# Altium schematic sheet 3V3-CAN-UNISOLATED.SchDoc
size A4; Organization: UNSW Solar Racing Team; Address3: UNSW; Address4: Sydney NSW 2052; Address2: Electrical Engineering; Address1: Rm 109
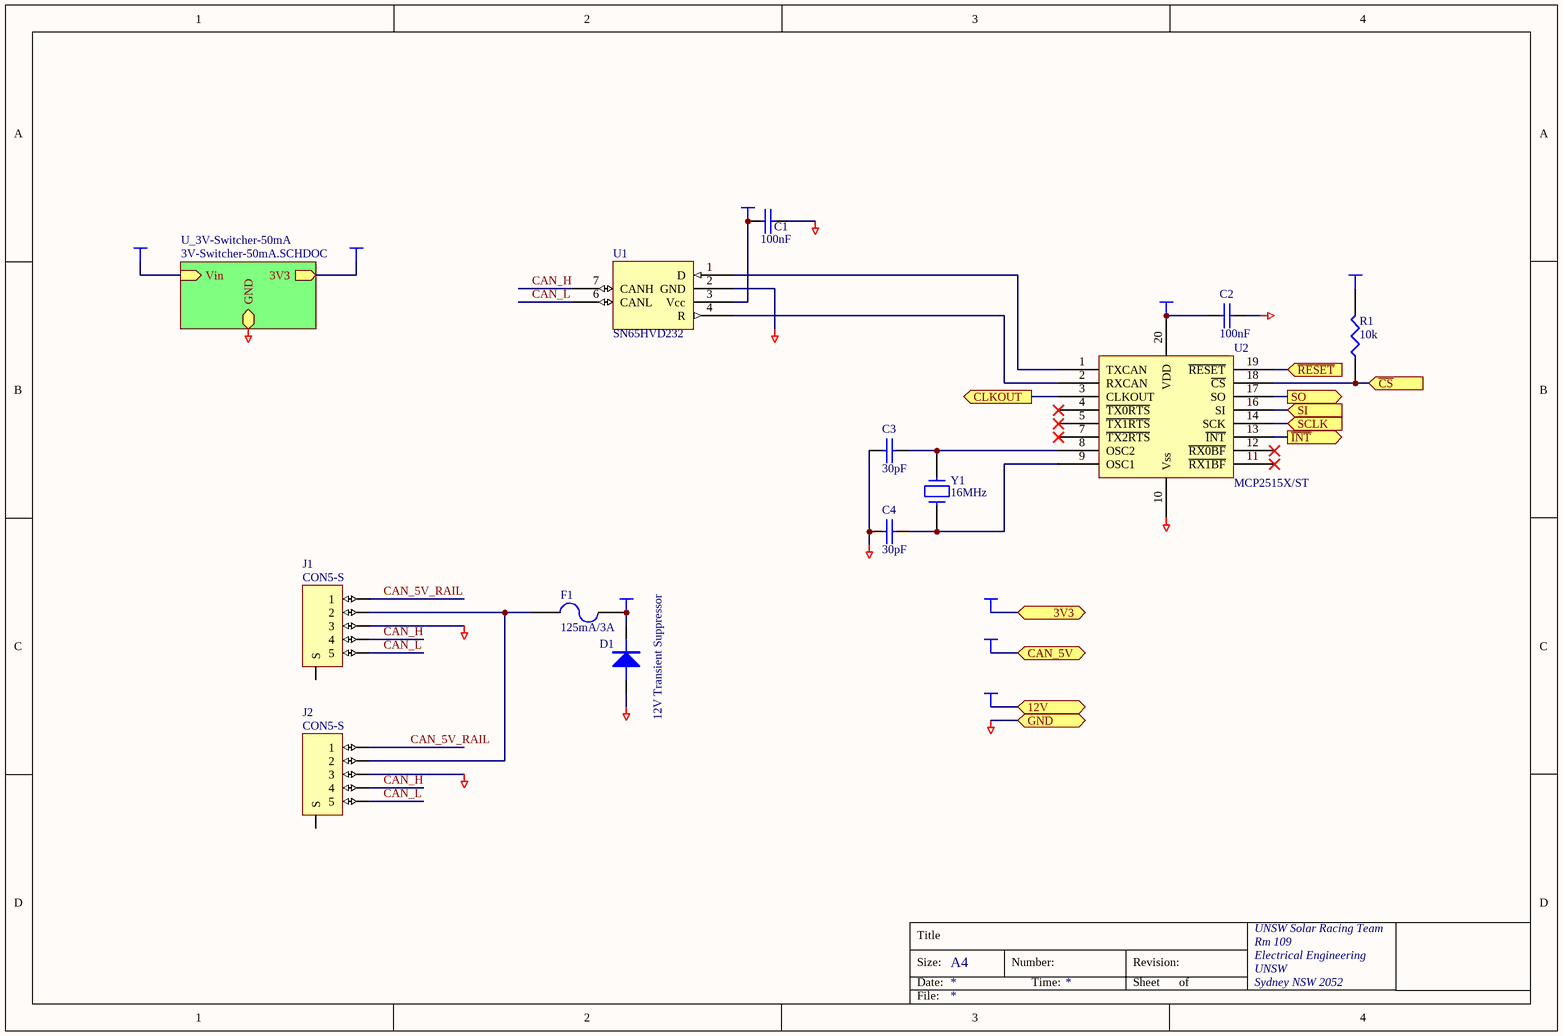
[diagram p0: 3V3-CAN-UNISOLATED.SchDoc]

## Parts
C1  100nF  [0603]
C2  100nF  [0603]
C3  30pF  [0603]
C4  30pF  [0603]
D1  12V Transient Suppressor  [SMA]
F1  125mA/3A  [LITTELFUSE-154]
J1  CON5-S  [TRIAD5F]
J2  CON5-S  [TRIAD5F]
R1  10k  [0603]
U1  SN65HVD232  [SO8]
U2  MCP2515X/ST  [TSSOP20]
Y1  16MHz  [HC49/4H]

## Sub-sheets
U_3V-Switcher-50mA = 3V-Switcher-50mA.SCHDOC: GND (bidir), 3V3 (out), Vin (in)

## Ports
3V3 (bidir), 12V, CAN_5V (bidir), CLKOUT (out), GND, SCLK (in), SI (in), SO (out), ~{CS} (in), ~{INT} (out), ~{RESET} (in)

## Nets
CAN+3V3: C1.2 C2.1 R1.2 U1.3(Vcc) U2.20(VDD) ; port 3V3, sheet U_3V-Switcher-50mA/3V3
CAN+5V: port CAN_5V
CAN+12V: D1.K F1.2 ; port 12V, sheet U_3V-Switcher-50mA/Vin
CANGND: C1.1 C2.2 C3.1 C4.1 D1.A J1.3 J2.3 U1.2(GND) U2.10(Vss) ; port GND, sheet U_3V-Switcher-50mA/GND
~{CS}: R1.1 U2.18(~{CS}) ; port ~{CS}
~{INT}: U2.13(~{INT}) ; port ~{INT}
~{RESET}: U2.19(~{RESET}) ; port ~{RESET}
CAN_5V_RAIL: J1.1 J2.1
CAN_H: J1.4 J2.4 U1.7(CANH)
CAN_L: J1.5 J2.5 U1.6(CANL)
CLKOUT: U2.3(CLKOUT) ; port CLKOUT
SCLK: U2.14(SCK) ; port SCLK
SI: U2.16(SI) ; port SI
SO: U2.17(SO) ; port SO
NetC3_2: C3.2 U2.8(OSC2) Y1.2
NetC4_2: C4.2 U2.9(OSC1) Y1.1
NetF1_1: F1.1 J1.2 J2.2
NetU1_1: U1.1(D) U2.1(TXCAN)
NetU1_4: U1.4(R) U2.2(RXCAN)

Not connected (* = marked no-connect by the designer): J1 0(S); J2 0(S); U2 4(~{TX0RTS})* 5(~{TX1RTS})* 7(~{TX2RTS})* 11(~{RX1BF})* 12(~{RX0BF})*

## Notes on the sheet
- Title
- Size:
- Date:
- A4
- Number:
- Time:
- Revision:
- Sheet
- of
- File:

## Library data of the parts
C1 C2 = CAP: Capacitor; Supplier: Stock
C3 C4 = CAP: Capacitor; Order#: 975-3494; Price: 0.13; Supplier: Farnell
D1 = DIODE: Order#: 980-2754; Price: 1.25; Supplier: Farnell
F1 = FUSE2: Fuse; Order#: 994-3609; Price: 7.78; Supplier: Farnell
J1 J2 = CON5-S: Connector, 2 pin, with shield @ S; Order#: 131-040; Price: 23.50; Supplier: Farnell
R1 = RES1: Supplier: Stock
U1 = SN65HVD232: 3.3V CAN Transciever; Order#: 296-12282-5-ND; Supplier: Digikey; Price: 2.93
U2 = MCP2510X/ST: MCP2510 CAN Controller; Order#: 321-6780; Price: 12.38; Supplier: Farnell
Y1 = CRYSTAL: Order#: 971-3700; Price: 2.31; Supplier: Farnell